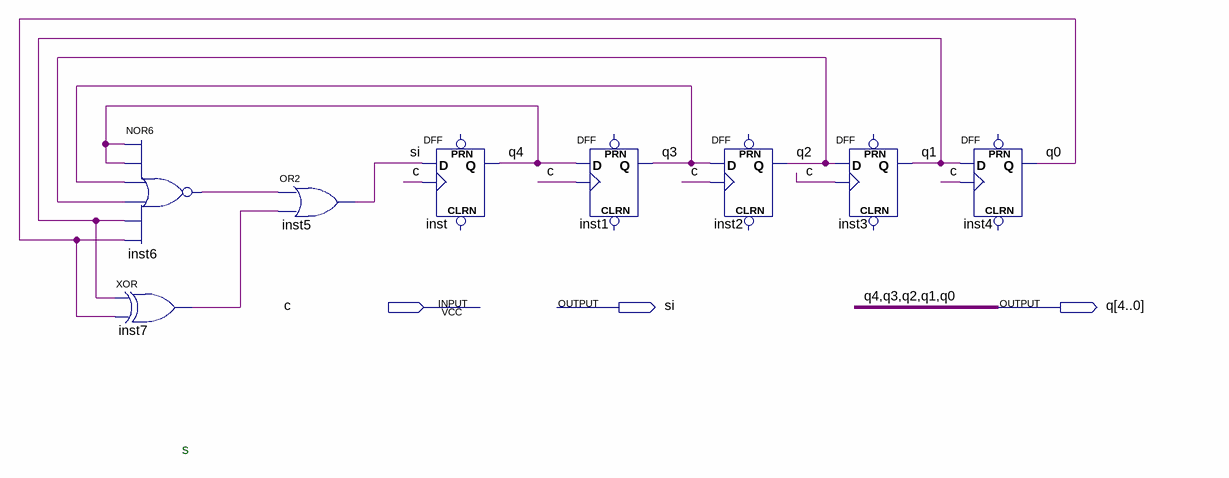
[diagram p0: schematic sheet]
// Quartus schematic w64.bdf as structural Verilog: 8 symbols, 3 pins
module w64 (
  input  c,
  output si,
  output [4:0] q
);

  wire inst6_out, inst7_out;

  nor inst6 (inst6_out, q[4], q[4], q[3], q[2], q[1], q[0]);
  xor inst7 (inst7_out, q[1], q[0]);
  or inst5 (si, inst6_out, inst7_out);
  DFF inst (.CLK(c), .D(si), .Q(q[4]));  // open: CLRN, PRN
  DFF inst1 (.CLK(c), .D(q[4]), .Q(q[3]));  // open: CLRN, PRN
  DFF inst2 (.CLK(c), .D(q[3]), .Q(q[2]));  // open: CLRN, PRN
  DFF inst3 (.CLK(c), .D(q[2]), .Q(q[1]));  // open: CLRN, PRN
  DFF inst4 (.CLK(c), .D(q[1]), .Q(q[0]));  // open: CLRN, PRN

  // Notes on the sheet:
  //   s
endmodule
